# Altium schematic sheet topsheet_Master.SchDoc
size A
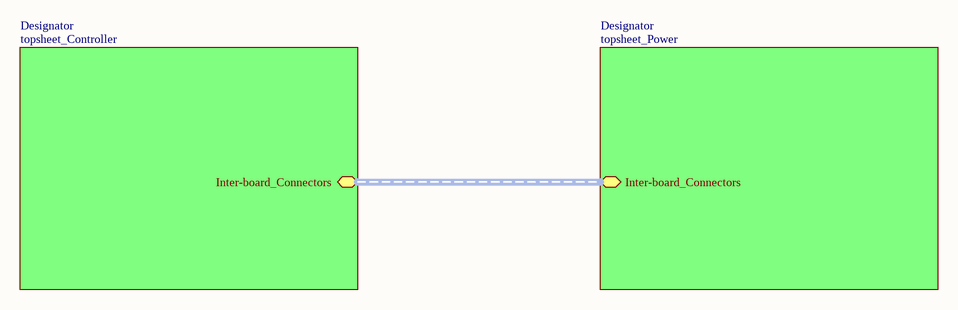
[diagram p0: topsheet_Master.SchDoc]

## Sub-sheets
Designator = topsheet_Controller: Inter-board_Connectors (harness Inter-board_Connector)
Designator = topsheet_Power: Inter-board_Connectors